# Altium schematic sheet 原理图.SchDoc
size A4
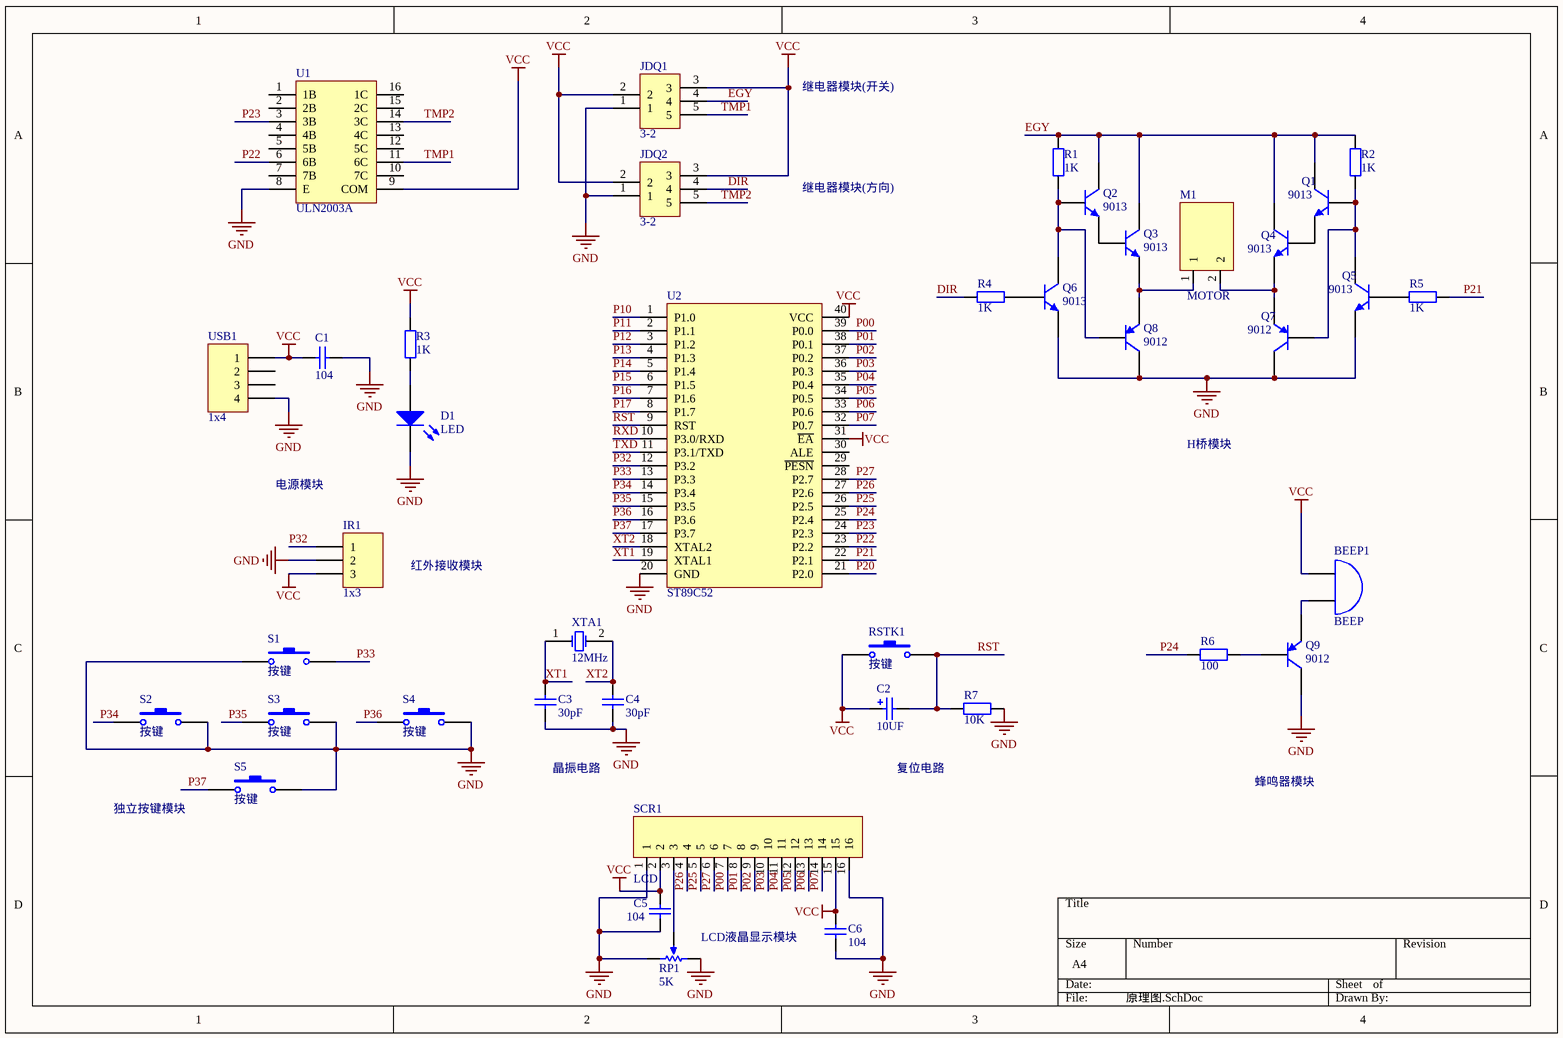
[diagram p0: 原理图.SchDoc]

## Parts
BEEP1  BEEP  [BEEP]
C1  104  [CAP]
C2  10UF  [CAP-ELEC]
C3  30pF  [CAP]
C4  30pF  [CAP]
C5  104  [CAP]
C6  104  [CAP]
D1  LED  [LED]
IR1  1x3  [RAY]
JDQ1  3-2  [RELAY]
JDQ2  3-2  [RELAY]
M1  MOTOR  [MOTOR]
Q1  9013  [PINS-3]
Q2  9013  [PINS-3]
Q3  9013  [PINS-3]
Q4  9013  [PINS-3]
Q5  9013  [PINS-3]
Q6  9013  [PINS-3]
Q7  9012  [PINS-3]
Q8  9012  [PINS-3]
Q9  9012  [PINS-3]
R1  1K  [RES]
R2  1K  [RES]
R3  1K  [RES]
R4  1K  [RES]
R5  1K  [RES]
R6  100  [RES]
R7  10K  [RES]
RP1  5K  [RES-ADJ]
RSTK1  按键  [KEY-4]
S1  按键  [KEY-4]
S2  按键  [KEY-4]
S3  按键  [KEY-4]
S4  按键  [KEY-4]
S5  按键  [KEY-4]
SCR1  LCD  [LCD]
U1  ULN2003A  [DIP16]
U2  ST89C52  [STC89C52]
USB1  1x4  [USB]
XTA1  12MHz  [CRYSTAL]

## Nets
GND: C1.1 C3.1 C4.1 C5.1 C6.1 D1.2(K) IR1.2 JDQ1.1 JDQ2.1 Q5.3(E) Q6.3(E) Q7.3(C) Q8.3(C) Q9.3(C) R7.1 RP1.1(TOP) RP1.3(BOT) S1.1 S2.2 S3.2 S4.2 S5.2 SCR1.1 SCR1.16 U1.8(E) U2.20(GND) USB1.4
VCC: BEEP1.1(A) C1.2 C2.1 C5.2 C6.2 IR1.3 JDQ1.2 JDQ1.3 JDQ2.2 JDQ2.3 R3.1 RSTK1.1 SCR1.2 SCR1.15 U1.9(COM) U2.31(~{EA}) U2.40(VCC) USB1.1
DIR: JDQ2.4 R4.1
EGY: JDQ1.4 Q1.1(C) Q2.1(C) Q3.1(C) Q4.1(C) R1.1 R2.1
P00: SCR1.7 U2.39(P0.0)
P01: SCR1.8 U2.38(P0.1)
P02: SCR1.9 U2.37(P0.2)
P03: SCR1.10 U2.36(P0.3)
P04: SCR1.11 U2.35(P0.4)
P05: SCR1.12 U2.34(P0.5)
P06: SCR1.13 U2.33(P0.6)
P07: SCR1.14 U2.32(P0.7)
P10: U2.1(P1.0)
P11: U2.2(P1.1)
P12: U2.3(P1.2)
P13: U2.4(P1.3)
P14: U2.5(P1.4)
P15: U2.6(P1.5)
P16: U2.7(P1.6)
P17: U2.8(P1.7)
P20: U2.21(P2.0)
P21: R5.1 U2.22(P2.1)
P22: U1.6(6B) U2.23(P2.2)
P23: U1.3(3B) U2.24(P2.3)
P24: R6.1 U2.25(P2.4)
P25: SCR1.5 U2.26(P2.5)
P26: SCR1.4 U2.27(P2.6)
P27: SCR1.6 U2.28(P2.7)
P32: IR1.1 U2.12(P3.2)
P33: S1.2 U2.13(P3.3)
P34: S2.1 U2.14(P3.4)
P35: S3.1 U2.15(P3.5)
P36: S4.1 U2.16(P3.6)
P37: S5.1 U2.17(P3.7)
RST: C2.2 R7.2 RSTK1.2 U2.9(RST)
RXD: U2.10(P3.0/RXD)
TMP1: JDQ1.5 U1.11(6C)
TMP2: JDQ2.5 U1.14(3C)
TXD: U2.11(P3.1/TXD)
XT1: C3.2 U2.19(XTAL1) XTA1.1(OSC1)
XT2: C4.2 U2.18(XTAL2) XTA1.2(OSC2)
NetBEEP1_2: BEEP1.2(B) Q9.1(E)
NetD1_1: D1.1(A) R3.2
NetM1_1: M1.1 Q3.3(E) Q8.1(E)
NetM1_2: M1.2 Q4.3(E) Q7.1(E)
NetQ1_2: Q1.2(B) Q5.1(C) Q7.2(B) R2.2
NetQ1_3: Q1.3(E) Q4.2(B)
NetQ2_2: Q2.2(B) Q6.1(C) Q8.2(B) R1.2
NetQ2_3: Q2.3(E) Q3.2(B)
NetQ5_2: Q5.2(B) R5.2
NetQ6_2: Q6.2(B) R4.2
NetQ9_2: Q9.2(B) R6.2
NetRP1_2: RP1.2(TAP) SCR1.3

Not connected (* = marked no-connect by the designer): U1 1(1B) 2(2B) 4(4B) 5(5B) 7(7B) 10(7C) 12(5C) 13(4C) 15(2C) 16(1C); U2 29(~{PESN}) 30(ALE); USB1 2 3

## Notes on the sheet
- 继电器模块(开关)
- 继电器模块(方向)
- H桥模块
- 电源模块
- 红外接收模块
- 晶振电路
- 复位电路
- 蜂鸣器模块
- 独立按键模块
- (near RP1) LCD液晶显示模块

## Library data of the parts
BEEP1 = 蜂鸣器
C1 C3-C6 = 瓷片电容
C2 = 电解电容
IR1 = 1x3: pin to pad: 1>3 3>1
JDQ1 JDQ2 = RELAY
Q1-Q6 = NPN: pin to pad: 1>3 3>1
Q7-Q9 = PNP
R1-R7 = 电阻
RP1 = 可调电阻
U2 = STC89C52
XTA1 = 晶振